# EAGLE design LED (EAGLE 6.2)
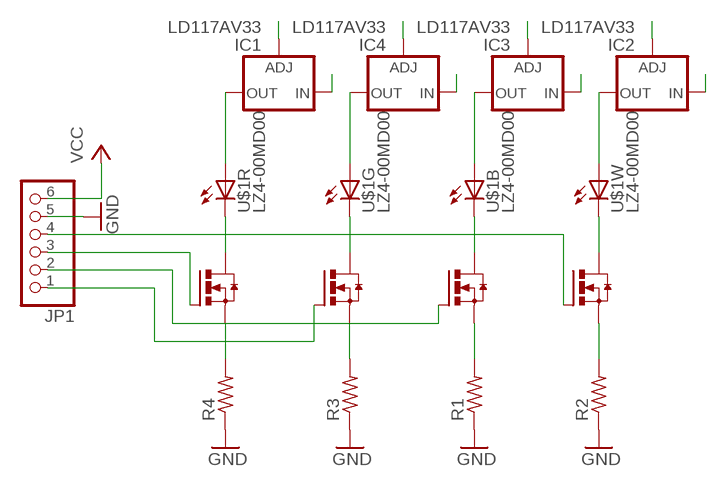
[diagram p0: schematic, sheet 1]

## Parts
IC1  LD117AV33  [TO220L1]
IC2  LD117AV33  [TO220L1]
IC3  LD117AV33  [TO220L1]
IC4  LD117AV33  [TO220L1]
JP1  PINHD-1X6  [1X06]
Q1  N-HEXFET_SOT323-  [SOT223]
Q2  N-HEXFET_SOT323-  [SOT223]
Q3  N-HEXFET_SOT323-  [SOT223]
Q4  N-HEXFET_SOT323-  [SOT223]
R1  R-US_0204/7  [0204/7]
R2  R-US_0204/7  [0204/7]
R3  R-US_0204/7  [0204/7]
R4  R-US_0204/7  [0204/7]
U$1  LZ4-00MD00  [LZ4-00MD0]

## Nets
BLUE: JP1.2 Q1.1(G)
GND: IC1.1(ADJ) IC2.1(ADJ) IC3.1(ADJ) IC4.1(ADJ) JP1.5 R1.1 R2.1 R3.1 R4.1
GREEN: JP1.1 Q2.1(G)
N$1: Q2.3(S) R3.2
N$6: Q3.3(S) R4.2
N$7: Q1.3(S) R1.2
N$8: Q4.3(S) R2.2
N$9: Q3.4(D) U$1.4(R:C)
N$10: Q2.4(D) U$1.6(G:C)
N$11: Q1.4(D) U$1.8(B:C)
N$12: Q4.4(D) U$1.2(W:C)
N$13: IC2.2(OUT) U$1.1(W:A)
N$14: IC3.2(OUT) U$1.7(B:A)
N$15: IC4.2(OUT) U$1.5(G:A)
N$16: IC1.2(OUT) U$1.3(R:A)
RED: JP1.3 Q3.1(G)
VCC: IC1.3(IN) IC2.3(IN) IC3.3(IN) IC4.3(IN) JP1.6
WHITE: JP1.4 Q4.1(G)

## Library data of the parts
IC1-IC4 = v-reg:LD117A?*: Low drop fixed and adjustable positive voltage regulators 1 A Source: http://www.st.com/stonline/products/literature/ds/7194/ld1117axx.pdf
JP1 = adafruit:PINHD-1X6: PIN HEADER
Q1-Q4 = transistor-power:N-HEXFET_?-*: HEXFET® Power MOSFET
R1-R4 = rcl:R-US_: RESISTOR, American symbol
U$1 = led:LZ4-00MD00

## Board
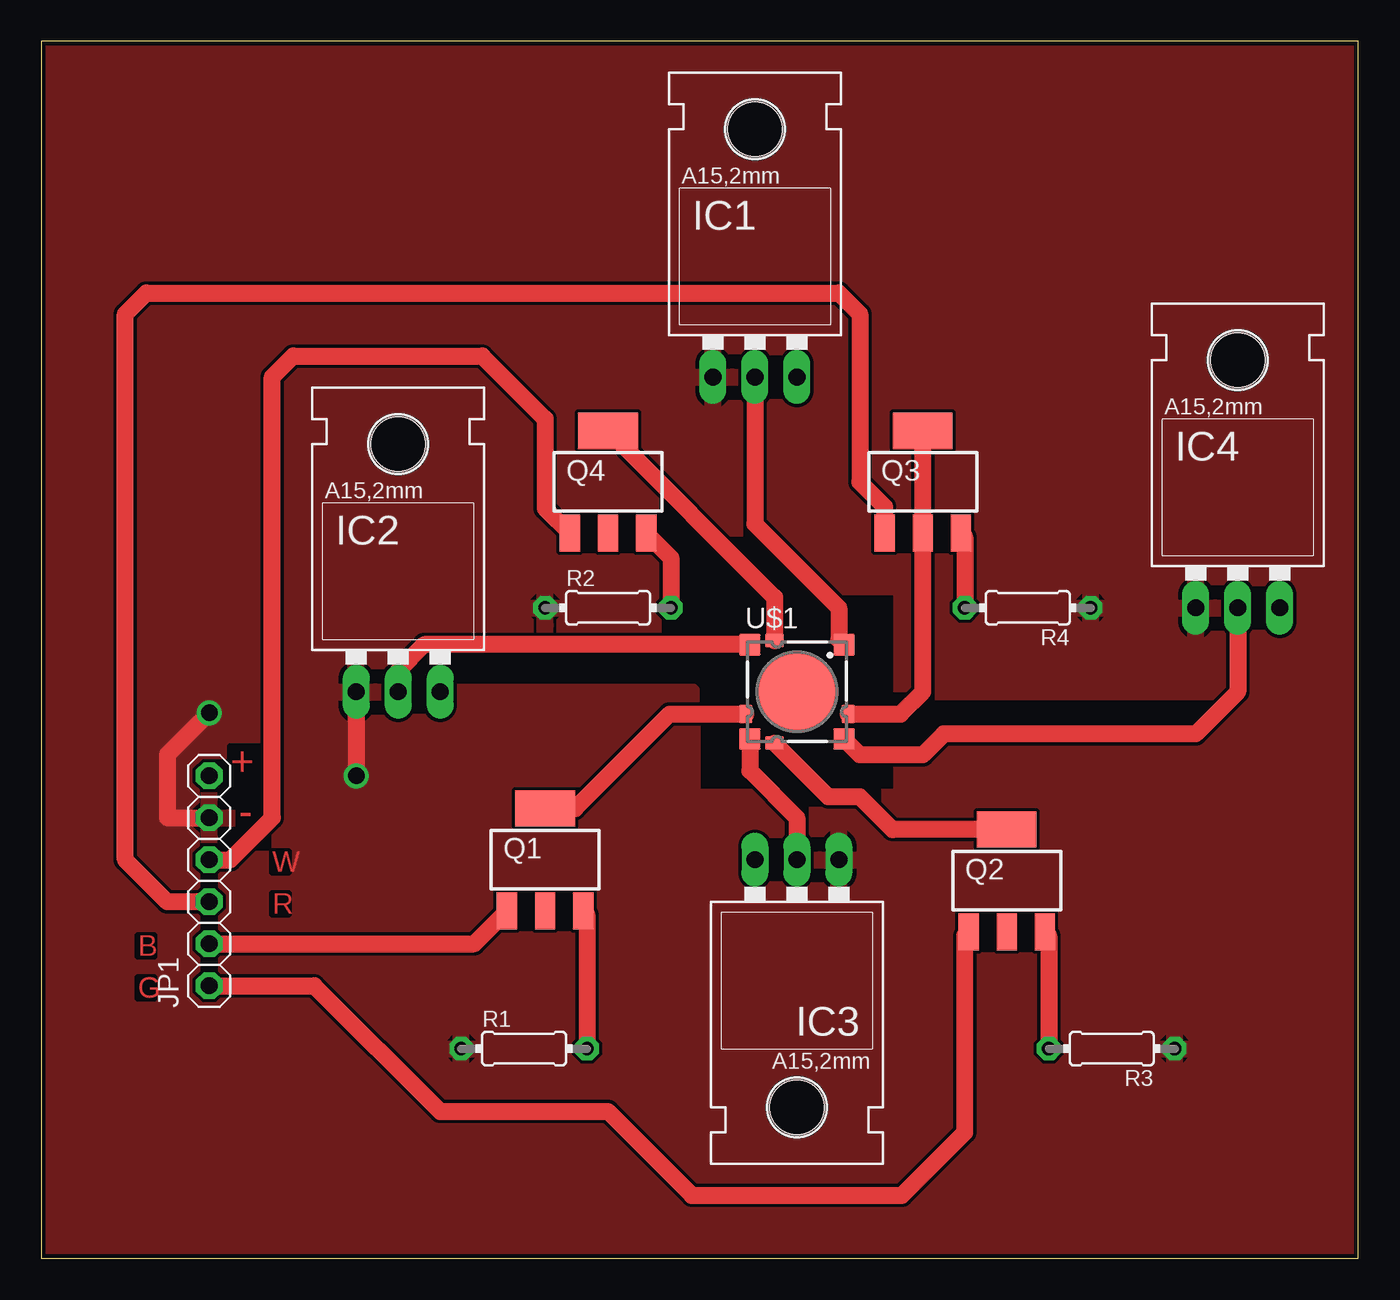
[diagram p1: board, top side]
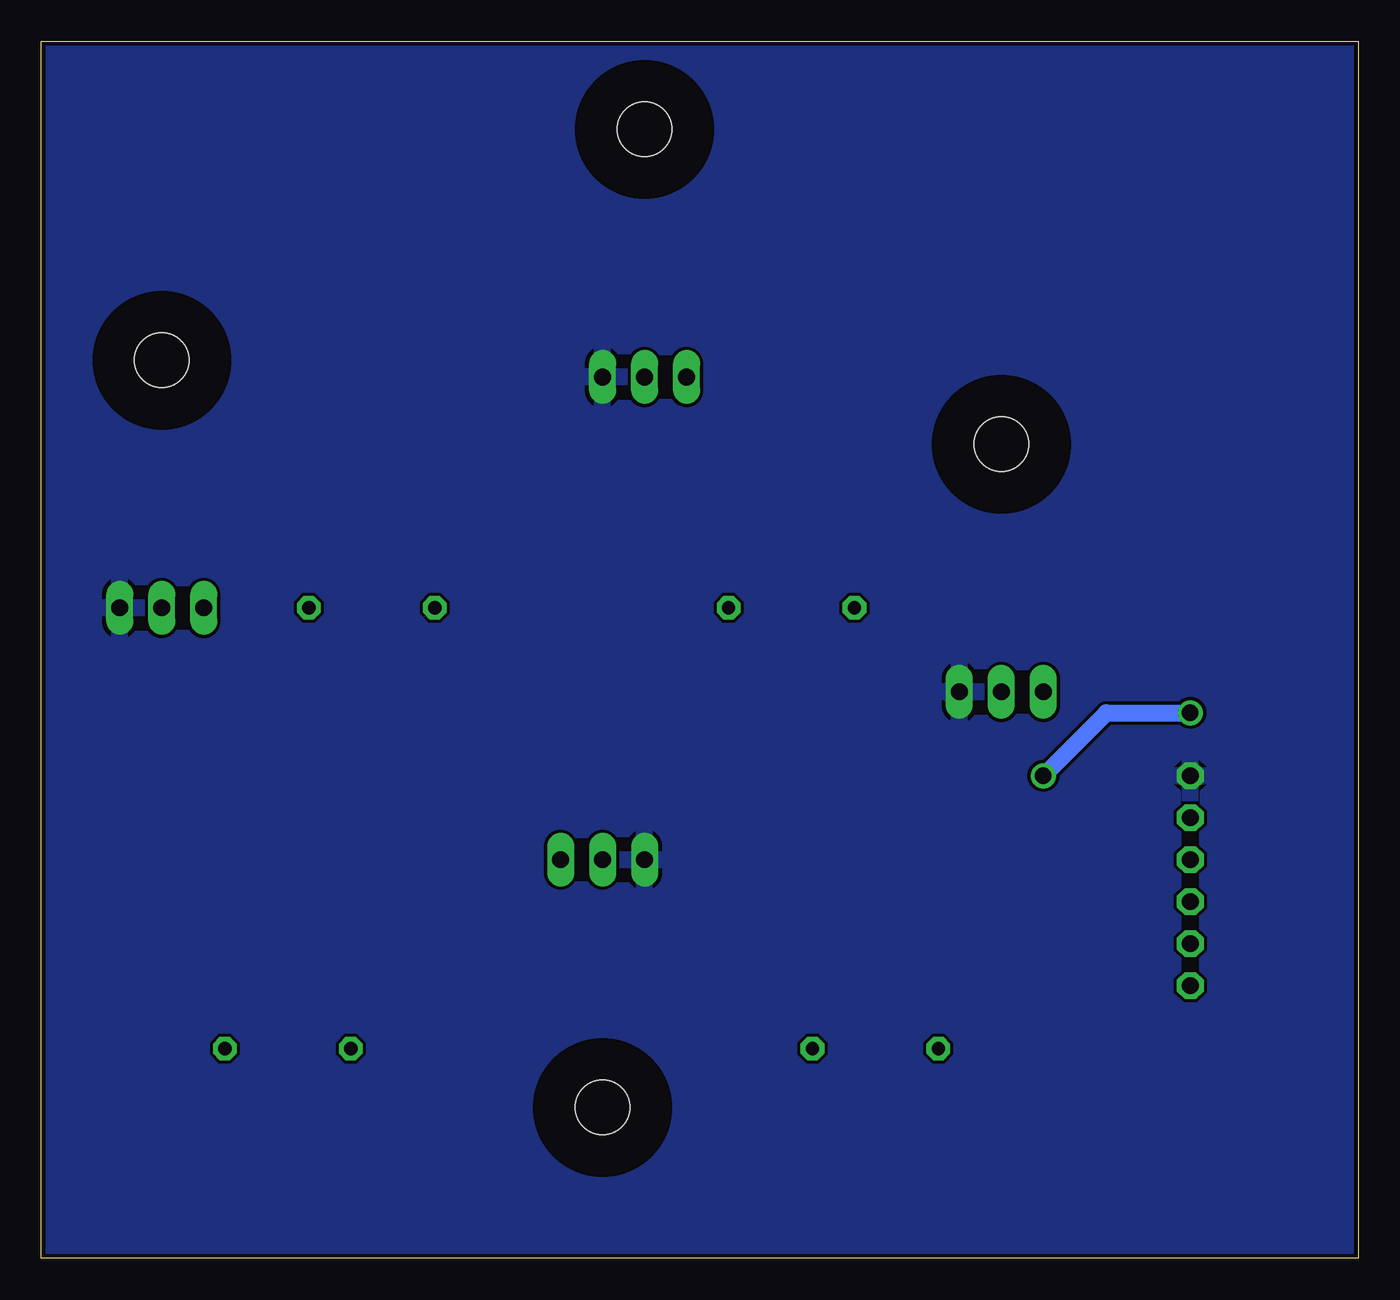
[diagram p2: board, bottom side, seen from below]

Size 79.68 x 73.65 mm. Coordinates in mm from the lower left corner, seen from the top.
Outline: 0,0 79.68,0 79.68,73.65 0,73.65 0,0
Copper layers (1*16): Top 0.035mm / dielectric 1.5mm / Bottom 0.035mm
Design rules: minimum track width 8mil, minimum drill 20mil, track to track 8mil, track to pad 8mil, pad to pad 8mil, via to via 8mil, smd to smd 8mil, copper to edge 10mil, drill to drill 8mil, minimum pad ring 12mil, minimum via ring 10mil, stop-mask expansion 4mil, vias tented up to drill 25mil, thermal gap 10mil

### Footprints (pad centres in the part's own frame; a part is rotated, then mirrored left to right if it is on the bottom)
TO220L1 = drill 1.016 long: 1 -2.54,-3.81; 2 0,-3.81; 3 2.54,-3.81 | hole 3.302: 0,11.176
1X06 = drill 1.016 octagon: 1 -6.35,0; 2 -3.81,0; 3 -1.27,0; 4 1.27,0; 5 3.81,0; 6 6.35,0
SOT223 = smd 1.219 x 2.235: 1 -2.311,-3.099; 2 0,-3.099; 3 2.311,-3.099 | smd 3.6 x 2.2: 4 0,3.099
0204/7 = drill 0.813 octagon: 1 -3.81,0; 2 3.81,0
LZ4-00MD0 = smd 1.3 x 1.3: 1 -2.85,2.85; 3 2.85,2.85; 5 2.85,-2.85; 7 -2.85,-2.85 | smd 1.1 x 0.8: 2 -1.35,3.1; 6 -1.35,-3.1 | smd 0.8 x 1.1: 4 3.1,-1.35; 8 -3.1,-1.35 | smd 5 x 5: 9 0,0

### Placement (x,y rotation side)
IC1  43.18,57.15 0 top
IC2  21.59,38.1 0 top
IC3  45.72,20.32 180 top
IC4  72.39,43.18 0 top
JP1  10.16,22.86 90 top
Q1  30.48,24.13 0 top
Q2  58.42,22.86 0 top
Q3  53.34,46.99 0 top
Q4  34.29,46.99 0 top
R1  29.21,12.7 0 top
R2  34.29,39.37 0 top
R3  64.77,12.7 180 top
R4  59.69,39.37 180 top
U$1  45.72,34.29 0 top

### Tracks (layer width: path | path; a pad name or v marks a point on that pad's centre or on a via)
BLUE
  Top 1.016: JP1.2 26.19,19.05 Q1.1
GND  (via drill 1)
  Top 1.016: IC2.1 v19.05,29.21 | v10.16,33.02 7.62,30.48 7.62,26.67 JP1.5
  Bottom 1.016: v19.05,29.21 15.24,33.02 v10.16,33.02
  pour Top: 0,73.66 80.01,73.66 80.01,34.29 52.07,34.29 52.07,40.64 39.37,40.64 39.37,34.29 0,34.29
  pour Top: 0,34.29 39.37,34.29 39.37,27.94 52.07,27.94 52.07,34.29 80.01,34.29 80.01,0 0,0
GREEN
  Top 1.016: JP1.1 16.51,16.51 24.13,8.89 34.29,8.89 39.37,3.81 52.07,3.81 55.88,7.62 55.88,19.53 Q2.1
N$1
  Top 1.016: Q2.3 60.96,19.53 R3.2
N$6
  Top 1.016: Q3.3 55.88,43.66 R4.2
N$7
  Top 1.016: Q1.3 33.02,20.8 R1.2
N$8
  Top 1.016: Q4.3 38.1,42.39 R2.2
N$9
  Top 1.016: U$1.4 51.99,32.94 53.34,34.29 Q3.4
N$10
  Top 1.016: Q2.4 51.51,25.96 49.53,27.94 47.62,27.94 U$1.6
N$11
  Top 1.016: Q1.4 32.31,27.23 38.02,32.94 U$1.8
N$12
  Top 1.016: Q4.4 44.37,40.01 U$1.2
N$13
  Top 1.016: U$1.1 23.17,37.14 21.59,35.56 IC2.2
N$14
  Top 1.016: U$1.7 42.87,29.52 45.72,26.67 IC3.2
N$15
  Top 1.016: IC4.2 72.39,34.29 69.85,31.75 54.61,31.75 53.34,30.48 49.53,30.48 U$1.5
N$16
  Top 1.016: IC1.2 43.18,44.45 48.26,39.37 48.26,37.45 U$1.3
RED
  Top 1.016: JP1.3 7.62,21.59 5.08,24.13 5.08,57.15 6.35,58.42 48.26,58.42 49.53,57.15 49.53,46.99 51.03,45.49 Q3.1
VCC
  pour Bottom: 0,73.66 80.01,73.66 80.01,0 0,0
WHITE
  Top 1.016: JP1.4 11.43,24.13 13.97,26.67 13.97,53.34 15.24,54.61 26.67,54.61 30.48,50.8 30.48,45.39 Q4.1

### Text on the board
Top: + | - | W | R | B | G